# Altium schematic sheet Sheet_motors.SchDoc
size A; SheetNumber: 1; SheetTotal: 1
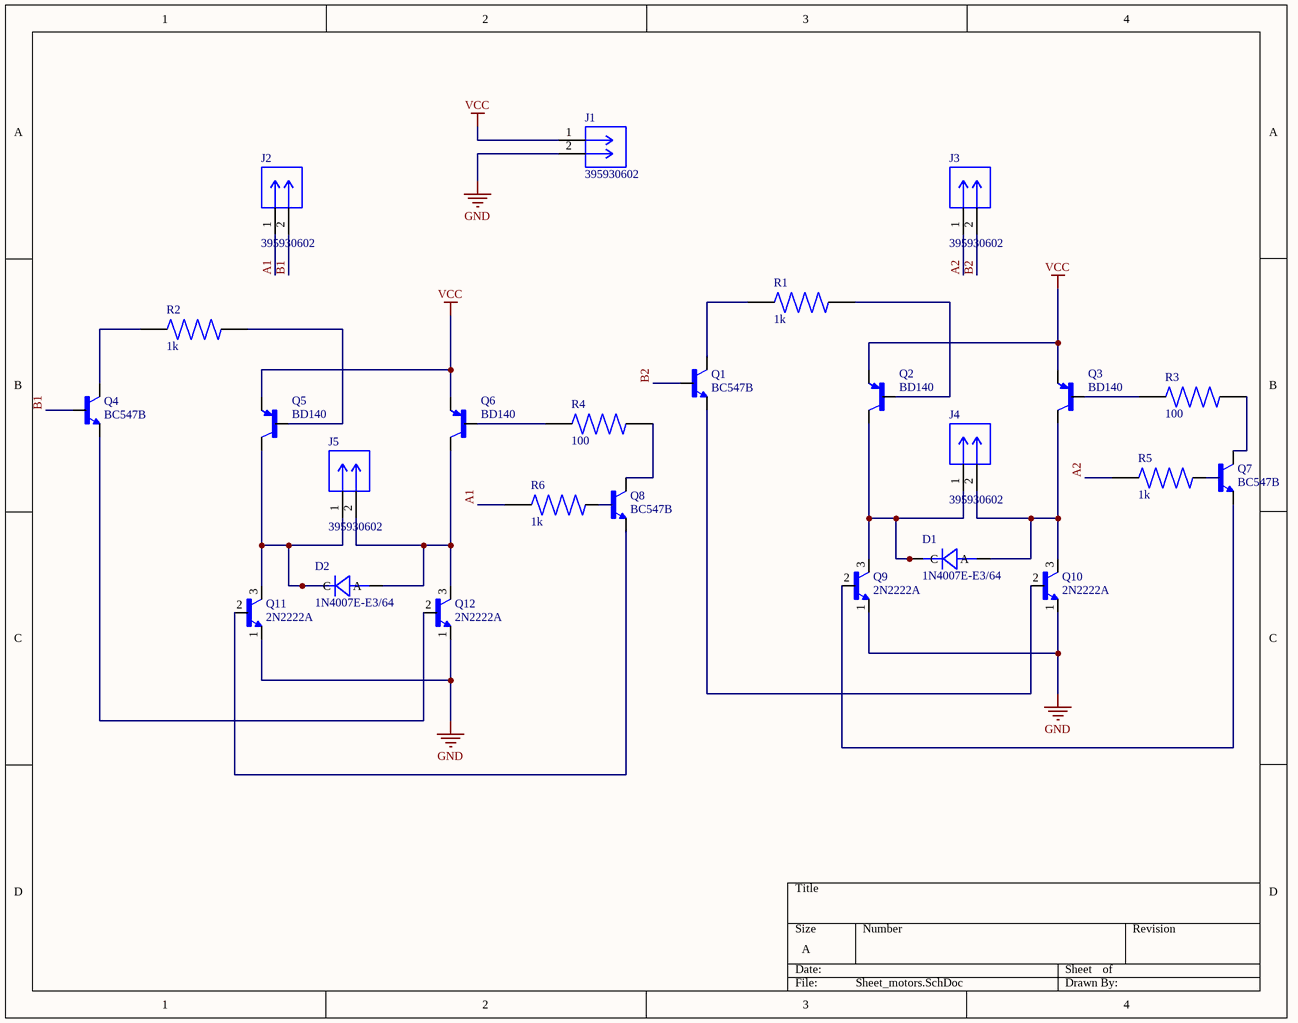
[diagram p0: Sheet_motors.SchDoc]

## Parts
D1  1N4007E-E3/64  [DIOAD520W79L463D238]
D2  1N4007E-E3/64  [DIOAD520W79L463D238]
J1  395930602  [CONN_SD-39543-004_NONE_02P_MOL]
J2  395930602  [CONN_SD-39543-004_NONE_02P_MOL]
J3  395930602  [CONN_SD-39543-004_NONE_02P_MOL]
J4  395930602  [CONN_SD-39543-004_NONE_02P_MOL]
J5  395930602  [CONN_SD-39543-004_NONE_02P_MOL]
Q1  BC547B  [TO92250P510H770-3]
Q2  BD140  [TO229P760X270X1364-3]
Q3  BD140  [TO229P760X270X1364-3]
Q4  BC547B  [TO92250P510H770-3]
Q5  BD140  [TO229P760X270X1364-3]
Q6  BD140  [TO229P760X270X1364-3]
Q7  BC547B  [TO92250P510H770-3]
Q8  BC547B  [TO92250P510H770-3]
Q9  2N2222A  [TO127P584H533-3]
Q10  2N2222A  [TO127P584H533-3]
Q11  2N2222A  [TO127P584H533-3]
Q12  2N2222A  [TO127P584H533-3]
R1  1k  [RESAD1100W55L680D260]
R2  1k  [RESAD1100W55L680D260]
R3  100  [RESAD1100W55L680D260]
R4  100  [RESAD1100W55L680D260]
R5  1k  [RESAD1100W55L680D260]
R6  1k  [RESAD1100W55L680D260]

## Nets
GND: J1.2 Q9.1(E) Q10.1(E) Q11.1(E) Q12.1(E)
VCC: J1.1 Q2.1(E) Q3.1(E) Q5.1(E) Q6.1(E)
A1: J2.1 R6.1
A2: J3.1 R5.1
B1: J2.2 Q4.2(B)
B2: J3.2 Q1.2(B)
NetD1_A: D1.A J4.2 Q3.2(C) Q10.3(C)
NetD1_C: D1.C J4.1 Q2.2(C) Q9.3(C)
NetD2_A: D2.A J5.2 Q6.2(C) Q12.3(C)
NetD2_C: D2.C J5.1 Q5.2(C) Q11.3(C)
NetQ1_1: Q1.1(C) R1.1
NetQ1_3: Q1.3(E) Q10.2(B)
NetQ2_3: Q2.3(B) R1.2
NetQ3_3: Q3.3(B) R3.1
NetQ4_1: Q4.1(C) R2.1
NetQ4_3: Q4.3(E) Q12.2(B)
NetQ5_3: Q5.3(B) R2.2
NetQ6_3: Q6.3(B) R4.1
NetQ7_1: Q7.1(C) R3.2
NetQ7_2: Q7.2(B) R5.2
NetQ7_3: Q7.3(E) Q9.2(B)
NetQ8_1: Q8.1(C) R4.2
NetQ8_2: Q8.2(B) R6.2
NetQ8_3: Q8.3(E) Q11.2(B)

## Library data of the parts
D1 D2 = 1N4007E-E3/64: Diode 1KV 1A 2-Pin DO-204AL T/R; MF: Vishay Semiconductor; SnapEDA_Link: https://www.snapeda.com/parts/1N4007E-E3/64/Vishay/view-part/?ref=snap; Package: DO-41 Vishay Semiconductor; Value: *; MP: 1N4007E-E3/64; Check_prices: https://www.snapeda.com/parts/1N4007E-E3/64/Vishay/view-part/?ref=eda
Q1 Q4 Q7 Q8 = BC547B: Bipolar (BJT) TransistÃ¶r NPN 45 V 100 mA 300MHz 625 mW Delikten TO-92 (TO-226); MF: ON Semiconductor; SnapEDA_Link: https://www.snapeda.com/parts/BC547B/Onsemi/view-part/?ref=snap; MP: BC547B; Availability: In Stock; Price: None; Value: *; Check_prices: https://www.snapeda.com/parts/BC547B/Onsemi/view-part/?ref=eda; Package: TO-92-3 ON Semiconductor; Purchase-URL: https://pricing.snapeda.com/search/part/BC547B/?ref=eda
Q2 Q3 Q5 Q6 = BD140: Bipolar (BJT) Transistor PNP 80 V 1.5 A - 1.25 W Through Hole TO-126-3; MF: ON Semiconductor; SnapEDA_Link: https://www.snapeda.com/parts/BD140/Onsemi/view-part/?ref=snap; Package: TO-225-3 ON Semiconductor; Value: *; MP: BD140; Check_prices: https://www.snapeda.com/parts/BD140/Onsemi/view-part/?ref=eda
Q9-Q12 = 2N2222A: Bipolar (BJT) Transistor NPN 50 V 800 mA - 500 mW Surface Mount 4-SMD; MF: Microsemi Corporation; SnapEDA_Link: https://www.snapeda.com/parts/2N2222A/Microsemi/view-part/?ref=snap; Package: None; Value: *; MP: 2N2222A; Check_prices: https://www.snapeda.com/parts/2N2222A/Microsemi/view-part/?ref=eda
R1-R6 = MFR-25FBF52-100K: 100 kOhms Â±1% 0.25W, 1/4W Through Hole Resistor Axial - Metal Film; MF: Yageo; SnapEDA_Link: https://www.snapeda.com/parts/MFR-25FBF52-100K/Yageo/view-part/?ref=snap; Package: RADIAL-2 YAGEO; Value: *; MP: MFR-25FBF52-100K; Check_prices: https://www.snapeda.com/parts/MFR-25FBF52-100K/Yageo/view-part/?ref=eda
J1-J5 = 395930602: Package: None; Price: None; Value: *; MP: 395930602; Availability: Unavailable